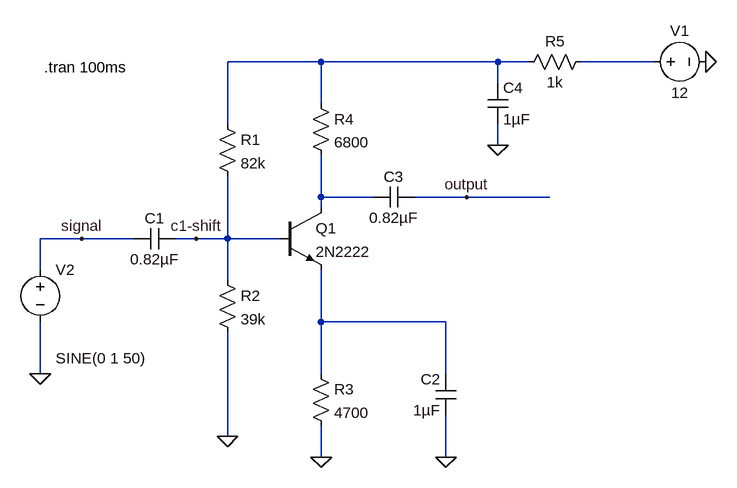
[diagram p0: schematic ClassA-Amplifier-01.asc]
ClassA-Amplifier-01.asc, the LTspice schematic file:
Version 4
SHEET 1 880 680
WIRE 160 -128 16 -128
WIRE 432 -128 160 -128
WIRE 480 -128 432 -128
WIRE 672 -128 560 -128
WIRE 432 -96 432 -128
WIRE 160 -64 160 -128
WIRE 16 -32 16 -128
WIRE 432 0 432 -32
WIRE 160 80 160 16
WIRE 240 80 160 80
WIRE 384 80 304 80
WIRE 512 80 384 80
WIRE 160 96 160 80
WIRE -208 144 -272 144
WIRE -128 144 -208 144
WIRE -32 144 -64 144
WIRE 16 144 16 48
WIRE 16 144 -32 144
WIRE 96 144 16 144
WIRE -272 192 -272 144
WIRE 16 208 16 144
WIRE 160 272 160 192
WIRE 352 272 160 272
WIRE -272 352 -272 272
WIRE 160 352 160 272
WIRE 352 352 352 272
WIRE 16 448 16 288
WIRE 160 480 160 432
WIRE 352 480 352 416
FLAG 16 448 0
FLAG 160 480 0
FLAG 432 0 0
FLAG 352 480 0
FLAG 752 -128 0
FLAG -272 352 0
FLAG -208 144 signal
FLAG 384 80 output
FLAG -32 144 c1-shift
SYMBOL cap 368 416 R180
WINDOW 0 24 56 Left 2
WINDOW 3 24 8 Left 2
SYMATTR InstName C2
SYMATTR Value 1µF
SYMATTR SpiceLine V=20
SYMBOL cap 240 96 R270
WINDOW 0 32 32 VTop 2
WINDOW 3 0 32 VBottom 2
SYMATTR InstName C3
SYMATTR Value 0.82µF
SYMBOL cap 416 -96 R0
SYMATTR InstName C4
SYMATTR Value 1µF
SYMBOL res 0 -48 R0
SYMATTR InstName R1
SYMATTR Value 82k
SYMBOL res 0 192 R0
SYMATTR InstName R2
SYMATTR Value 39k
SYMBOL res 144 336 R0
SYMATTR InstName R3
SYMATTR Value 4700
SYMBOL res 144 -80 R0
SYMATTR InstName R4
SYMATTR Value 6800
SYMBOL res 576 -144 R90
WINDOW 0 0 56 VBottom 2
WINDOW 3 32 56 VTop 2
SYMATTR InstName R5
SYMATTR Value 1k
SYMBOL voltage 656 -128 R270
WINDOW 0 32 56 VTop 2
WINDOW 3 -32 56 VBottom 2
WINDOW 123 0 0 Left 2
WINDOW 39 0 0 Left 2
SYMATTR InstName V1
SYMATTR Value 12
SYMBOL voltage -272 176 R0
WINDOW 3 24 152 Left 2
WINDOW 123 24 124 Left 2
WINDOW 39 0 0 Left 2
SYMATTR InstName V2
SYMATTR Value SINE(0 1 50)
SYMBOL npn 96 96 R0
SYMATTR InstName Q1
SYMATTR Value 2N2222
SYMBOL cap -128 160 R270
WINDOW 0 32 32 VTop 2
WINDOW 3 0 32 VBottom 2
SYMATTR InstName C1
SYMATTR Value 0.82µF
TEXT -266 -120 Left 2 !.tran 100ms

The netlist it stands for:
* ClassA-Amplifier-01.asc
C2 0 N004 1µF V=20
C3 N003 output 0.82µF
C4 N001 0 1µF
R1 N001 c1-shift 82k
R2 c1-shift 0 39k
R3 N004 0 4700
R4 N001 N003 6800
R5 N002 N001 1k
V1 N002 0 12
V2 signal 0 SINE(0 1 50)
Q1 N003 c1-shift N004 0 2N2222
C1 signal c1-shift 0.82µF
.model NPN NPN
.model PNP PNP
.lib standard.bjt
.tran 100ms
.backanno
.end